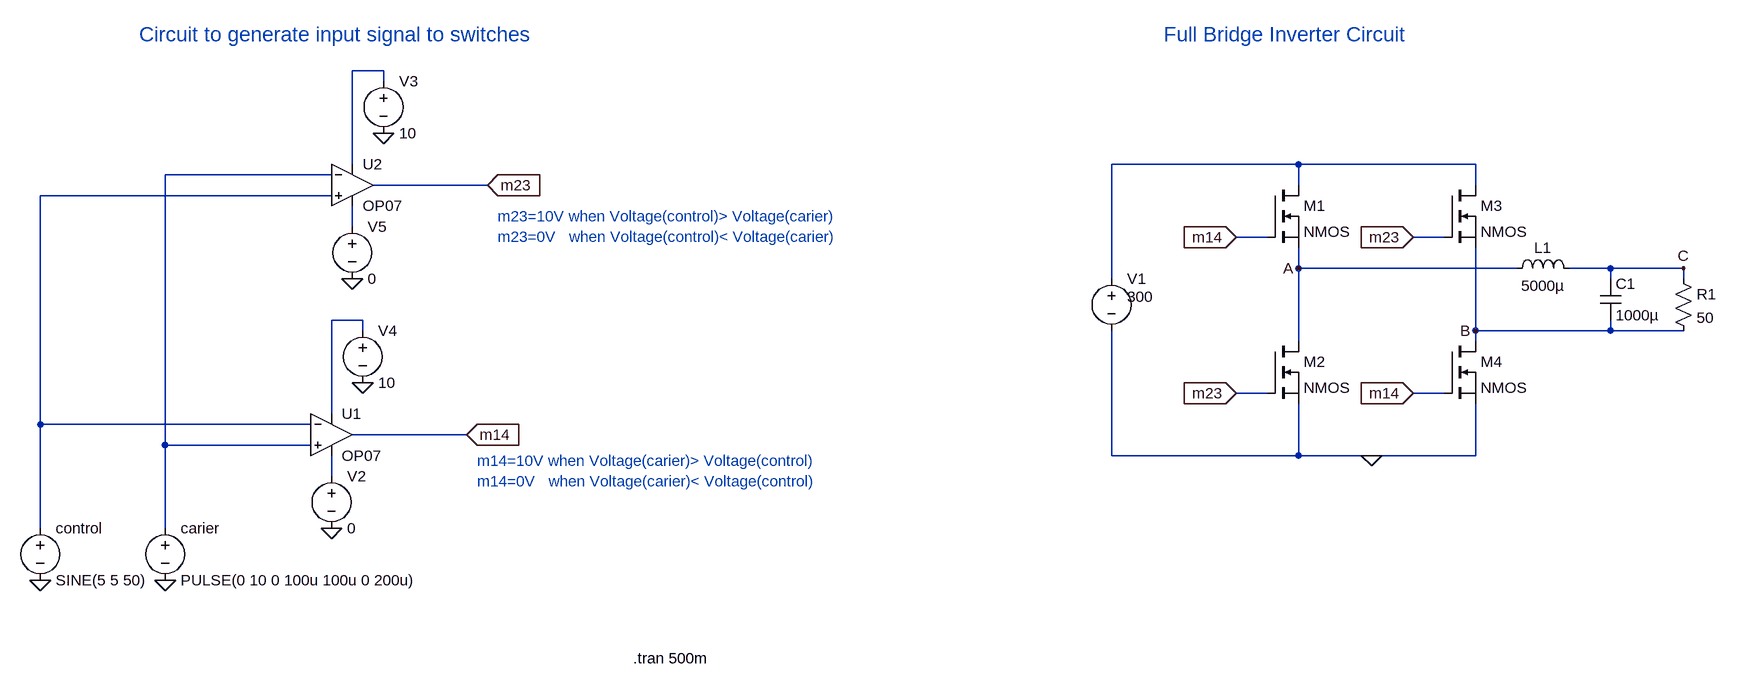
[diagram p0: schematic inverter.asc]
inverter.asc, the LTspice schematic file:
Version 4
SHEET 1 2112 824
WIRE -1248 -96 -1296 -96
WIRE -1248 -80 -1248 -96
WIRE -1296 48 -1296 -96
WIRE 160 48 -128 48
WIRE 432 48 160 48
WIRE -1328 64 -1584 64
WIRE -1088 80 -1264 80
WIRE 160 80 160 48
WIRE 432 80 432 48
WIRE -1328 96 -1776 96
WIRE -1296 144 -1296 112
WIRE 112 160 64 160
WIRE 384 160 336 160
WIRE 160 208 160 176
WIRE 496 208 160 208
WIRE 640 208 576 208
WIRE 752 208 640 208
WIRE -128 224 -128 48
WIRE 640 224 640 208
WIRE 752 224 752 208
WIRE -1280 288 -1328 288
WIRE -1280 304 -1280 288
WIRE 432 304 432 176
WIRE 640 304 640 288
WIRE 640 304 432 304
WIRE 752 304 640 304
WIRE 160 320 160 208
WIRE 432 320 432 304
WIRE 112 400 64 400
WIRE 384 400 336 400
WIRE -1328 432 -1328 288
WIRE -1776 448 -1776 96
WIRE -1360 448 -1776 448
WIRE -1120 464 -1296 464
WIRE -1584 480 -1584 64
WIRE -1360 480 -1584 480
WIRE -128 496 -128 304
WIRE 160 496 160 416
WIRE 160 496 -128 496
WIRE 272 496 160 496
WIRE 432 496 432 416
WIRE 432 496 272 496
WIRE -1328 528 -1328 496
WIRE -1776 608 -1776 448
WIRE -1584 608 -1584 480
FLAG -1584 688 0
FLAG 272 496 0
FLAG -1776 688 0
FLAG -1280 384 0
FLAG -1120 464 m14
IOPIN -1120 464 In
FLAG -1328 608 0
FLAG 64 160 m14
IOPIN 64 160 In
FLAG 336 400 m14
IOPIN 336 400 In
FLAG 336 160 m23
IOPIN 336 160 In
FLAG 64 400 m23
IOPIN 64 400 In
FLAG -1248 0 0
FLAG -1088 80 m23
IOPIN -1088 80 In
FLAG -1296 224 0
FLAG 160 208 A
FLAG 432 304 B
FLAG 752 208 C
SYMBOL nmos 112 80 R0
SYMATTR InstName M1
SYMBOL nmos 112 320 R0
SYMATTR InstName M2
SYMBOL nmos 384 80 R0
SYMATTR InstName M3
SYMBOL nmos 384 320 R0
SYMATTR InstName M4
SYMBOL ind 480 224 R270
WINDOW 0 32 56 VTop 2
WINDOW 3 5 56 VBottom 2
SYMATTR InstName L1
SYMATTR Value 5000µ
SYMBOL cap 624 224 R0
SYMATTR InstName C1
SYMATTR Value 1000µ
SYMBOL res 736 208 R0
SYMATTR InstName R1
SYMATTR Value 50
SYMBOL voltage -128 208 R0
WINDOW 3 24 44 Left 2
WINDOW 123 0 0 Left 0
WINDOW 39 0 0 Left 0
SYMATTR Value 300
SYMATTR InstName V1
SYMBOL voltage -1584 592 R0
WINDOW 123 0 0 Left 0
WINDOW 39 0 0 Left 0
SYMATTR InstName carier
SYMATTR Value PULSE(0 10 0 100u 100u 0 200u)
SYMBOL OpAmps\\OP07 -1328 400 R0
SYMATTR InstName U1
SYMBOL voltage -1776 592 R0
WINDOW 123 0 0 Left 0
WINDOW 39 0 0 Left 0
SYMATTR InstName control
SYMATTR Value SINE(5 5 50)
SYMBOL voltage -1280 288 R0
WINDOW 123 0 0 Left 0
WINDOW 39 0 0 Left 0
SYMATTR InstName V4
SYMATTR Value 10
SYMBOL voltage -1328 512 R0
WINDOW 123 0 0 Left 0
WINDOW 39 0 0 Left 0
SYMATTR InstName V2
SYMATTR Value 0
SYMBOL OpAmps\\OP07 -1296 16 R0
SYMATTR InstName U2
SYMBOL voltage -1248 -96 R0
WINDOW 123 0 0 Left 0
WINDOW 39 0 0 Left 0
SYMATTR InstName V3
SYMATTR Value 10
SYMBOL voltage -1296 128 R0
WINDOW 123 0 0 Left 0
WINDOW 39 0 0 Left 0
SYMATTR InstName V5
SYMATTR Value 0
TEXT -864 808 Left 2 !.tran 500m
TEXT -1072 128 Left 2 ;m23=10V when Voltage(control)> Voltage(carier)\nm23=0V   when Voltage(control)< Voltage(carier)
TEXT -1104 504 Left 2 ;m14=10V when Voltage(carier)> Voltage(control)\nm14=0V   when Voltage(carier)< Voltage(control)
TEXT -1624 -152 Left 3 ;Circuit to generate input signal to switches
TEXT -48 -152 Left 3 ;Full Bridge Inverter Circuit

The netlist it stands for:
* inverter.asc
M1 N002 m14 A A NMOS
M2 A m23 0 0 NMOS
M3 N002 m23 B B NMOS
M4 B m14 0 0 NMOS
L1 A C 5000µ
C1 C B 1000µ
R1 C B 50
V1 N002 0 300
V§carier N003 0 PULSE(0 10 0 100u 100u 0 200u)
XU1 N003 N004 N006 N007 m14 LT1001  ; OP07, pins In+ In- V+ V- OUT
V§control N004 0 SINE(5 5 50)
V4 N006 0 10
V2 N007 0 0
XU2 N004 N003 N001 N005 m23 LT1001  ; OP07, pins In+ In- V+ V- OUT
V3 N001 0 10
V5 N005 0 0
.model NMOS NMOS
.model PMOS PMOS
.lib standard.mos
.tran 500m
* m23=10V when Voltage(control)> Voltage(carier)
* m23=0V   when Voltage(control)< Voltage(carier)
* m14=10V when Voltage(carier)> Voltage(control)
* m14=0V   when Voltage(carier)< Voltage(control)
* Circuit to generate input signal to switches
* Full Bridge Inverter Circuit
.lib LTC.lib
.backanno
.end